# Altium schematic sheet e-ink_display.SchDoc
size A4; SheetNumber: 2; SheetTotal: 4
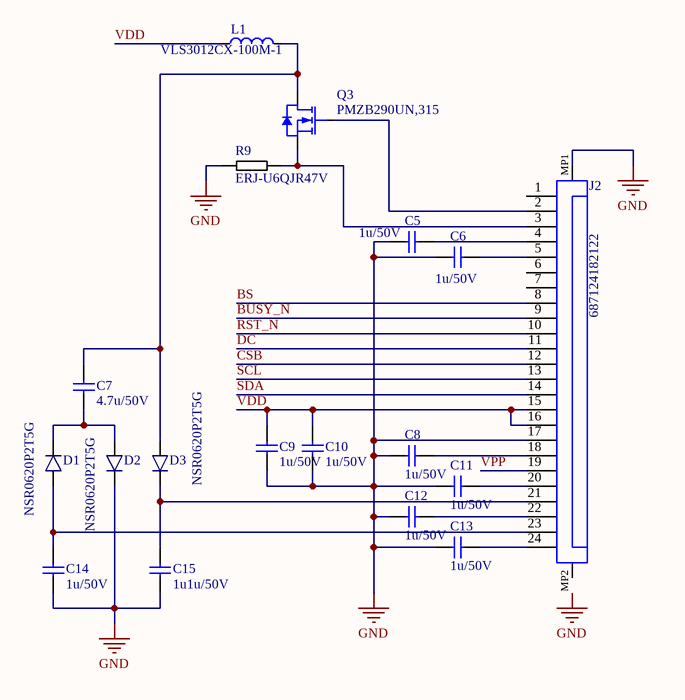
[diagram p0: e-ink_display.SchDoc]

## Parts
C5  1u/50V  [CAPC1005X04L]
C6  1u/50V  [CAPC1005X04L]
C7  4.7u/50V  [CAPC1005X04L]
C8  1u/50V  [CAPC1005X04L]
C9  1u/50V  [CAPC1005X04L]
C10  1u/50V  [CAPC1005X04L]
C11  1u/50V  [CAPC1005X04L]
C12  1u/50V  [CAPC1005X04L]
C13  1u/50V  [CAPC1005X04L]
C14  1u/50V  [CAPC1005X04L]
C15  1u1u/50V  [CAPC1005X04L]
D1  NSR0620P2T5G  [SODFL100X40-2N]
D2  NSR0620P2T5G  [SODFL100X40-2N]
D3  NSR0620P2T5G  [SODFL100X40-2N]
J2  687124182122  [687124182122]
L1  VLS3012CX-100M-1  [VLS3012CX-100M-1]
Q3  PMZB290UN,315  [NXP-SOT883B_N]
R9  ERJ-U6QJR47V  [R0805]

## Nets
GND: C5.1 C6.1 C8.1 C9.1 C10.1 C11.1 C12.1 C13.1 C14.1 C15.1 D2.1(C) J2.17 J2.MP1 R9.1
BS: J2.8
BUSY_N: J2.9
CSB: J2.12
DC: J2.11
RST_N: J2.10
SCL: J2.13
SDA: J2.14
VDD: C9.2 C10.2 J2.15 J2.16 L1.1
VPP: J2.19
NetC5_2: C5.2 J2.4
NetC6_2: C6.2 J2.5
NetC7_1: C7.1 D1.1(C) D2.2(A)
NetC7_2: C7.2 D3.2(A) L1.2 Q3.3(D)
NetC8_2: C8.2 J2.18
NetC11_2: C11.2 J2.20
NetC12_2: C12.2 J2.22
NetC13_2: C13.2 J2.24
NetC14_2: C14.2 D1.2(A) J2.23
NetC15_2: C15.2 D3.1(C) J2.21
NetJ2_2: J2.2 Q3.1(G)
NetJ2_3: J2.3 Q3.2(S) R9.1

Not connected (* = marked no-connect by the designer): J2 1 6 7 MP2

## Notes on the sheet
- Labels drawn without touching a wire or pin: GND

## Library data of the parts
C5-C15 = C0402
D1-D3 = NSR0620P2T5G: 20V schottky barrier diode, Vf 350 mV @ 100 mA, Ir 2.0 µA @ 10 V, If 500 mA; Manufacturer: ON Semiconductor; Part number IPS: 00000009952; Note: N.A.; Artikkelnr Noca: 10029169; Pad Count: 2; Part Number: NSR0620P2T5G; Manufacturer Part Number: NSR0620P2T5G; LatestRevisionDate: 2016-07-07; Published: 2016-07-07; Value: NSR0620P2T5G; Footprint Doc: SOD-923; ComponentLink1URL: N.A.; ComponentLink1Description: Datasheet; ComponentLink2URL: N.A.; ComponentLink2Description: Supplier link; HelpURL: http://www.onsemi.com/pub_link/Collateral/NSR0620P2-D.PDF; Supplier 1: Digi-Key; Supplier Part Number 1: NSR0620P2T5GOSCT-ND; Supplier 2: N.A.; Supplier Part Number 2: N.A.; Component Class: Semiconductors; PartId: 101300131
J2 = 687124182122: WR-FPC SMT ZIF Horizontal Dual Contact, pitch 0.5mm, 24p; Manufacturer: Wurth Elektronik; Contact Resistance: 30mOhm; Pin Number: 24; Working Voltage: 50VAC; Rated Current: 0.5A; ComponentLink1Description: Manufacturer; ComponentLink1URL: http://www.we-online.de; ComponentLink2Description: Datasheet; ComponentLink2URL: https://katalog.we-online.com/em/datasheet/687124182122.pdf; Packaging: Tape and Reel; Pitch: 0.5mm; Published Date: March 2021; Mounting Technology: SMT; Operating Temperature: -25 to +85degC; Length: 14mm; Manufacturer Part Number: 687124182122; Type: Horizontal
L1 = VLS3012CX-100M-1: Inductor Power Shielded Wirewound 10uH 20% 1MHz Ferrite 1.12A 0.324Ohm DCR 1212 T/R; Manufacturer: TDK; Current Rating: 1.25A; Saturation Current: 1A; DC Resistance (DCR): 324mR; Supplier 1: Mouser; Manufacturer Part Number: VLS3012CX-100M-1; RoHS: Yes; Category: Fixed Inductors; Stock 1: 61514; Pricing 1: 1=0.42000, 10=0.27800, 50=0.27800, 100=0.23100, 1000=0.16700, 10000=0.13600 (USD); Mount: Surface Mount; Case/Package: Nonstandard; Core Material: Ferrite; Min Operating Temperature: -40°C; Max Operating Temperature: 105°C; Resistor Type: Wirewound; Packaging: Tape and Reel; Inductance: 10uH; Tolerance: 20%; Shielding: Shielded; Test Frequency: 1MHz; RoHS Compliant: Yes; ComponentLink1URL: https://product.tdk.com/info/en/catalog/datasheets/inductor_commercial_power_vls3012cx-1_en.pdf?src-supplier=Digi-Key; ComponentLink1Description: https://product.tdk.com/info/en/catalog/datasheets/inductor_commercial_power_vls3012cx-1_en.pdf?src-supplier=Digi-Key; Supplier Part Number 1: 810-VLS3012CX-100M-1
Q3 = PMZB290UN,315: PMZB290UN - 20 V, single N-channel Trench MOSFET; Manufacturer: NXP Semiconductors; Rise Time: 10ns; Continuous Drain Current (ID): 1A; Gate to Source Voltage (Vgs): 8V; Turn-On Delay Time: 4.5ns; Turn-Off Delay Time: 18.5ns; Fall Time: 5ns; Rds On Max: 380mR; Input Capacitance: 83pF; Max Dual Supply Voltage: 20V; Max Power Dissipation: 360mW; Supplier 1: Mouser; Manufacturer Part Number: PMZB290UN,315; RoHS: Yes; Category: MOSFETs; Case/Package: DFN; Number of Pins: 3; Min Operating Temperature: -55°C; Max Operating Temperature: 150°C; Package Quantity: 1; Packaging: Tape and Reel; Drain to Source Voltage (Vdss): 20V; Series: -; Radiation Hardening: No; RoHS Compliant: Yes; ComponentLink1URL: https://datasheet.ciiva.com/11165/pmzb290un-11165755.pdf?src-supplier=Avnet; ComponentLink1Description: https://datasheet.ciiva.com/11165/pmzb290un-11165755.pdf?src-supplier=Avnet; ComponentLink2URL: https://datasheet.ciiva.com/25647/pmzb290une-25647430.pdf?src-supplier=Digi-Key; ComponentLink2Description: https://datasheet.ciiva.com/25647/pmzb290une-25647430.pdf?src-supplier=Digi-Key; ComponentLink3URL: https://datasheet.ciiva.com/29742/pmzb290une-29742088.pdf?src-supplier=Digi-Key; ComponentLink3Description: https://datasheet.ciiva.com/29742/pmzb290une-29742088.pdf?src-supplier=Digi-Key; ComponentLink4URL: https://datasheet.ciiva.com/29742/pmzb290une-29742092.pdf?src-supplier=Digi-Key; ComponentLink4Description: https://datasheet.ciiva.com/29742/pmzb290une-29742092.pdf?src-supplier=Digi-Key; Supplier Part Number 1: 771-PMZB290UN,315
R9 = ERJ-U6QJR47V: Anti-Sulfurated Thick Film Chip Resistors, 0.47½, 5%, 0.25W; Manufacturer: Panasonic; Resistance: 470mR; Max Power Dissipation: 250mW; Temperature Coefficient: 150ppm/°C; Supplier 1: Mouser; Manufacturer Part Number: ERJ-U6QJR47V; RoHS: No; Category: Chip SMD Resistors; Stock 1: 10093; Pricing 1: 1=0.51000, 10=0.37200, 50=0.37200, 100=0.15500, 1000=0.07900, 10000=0.07000 (USD); Case/Package: 0805; Case Code (Imperial): 0805; Case Code (Metric): 2012; Min Operating Temperature: -55°C; Max Operating Temperature: 155°C; Features: Automotive AEC-Q200,Anti-Sulfur; Packaging: Cut Tape; Tolerance: 5%; Number of Terminations: 2; Resistor Type: Thick Film; ComponentLink1URL: https://industrial.panasonic.com/cdbs/www-data/pdf/RDP0000/AOA0000C334.pdf?src-supplier=Digi-Key; ComponentLink1Description: https://industrial.panasonic.com/cdbs/www-data/pdf/RDP0000/AOA0000C334.pdf?src-supplier=Digi-Key; Supplier Part Number 1: 667-ERJ-U6QJR47V